# EAGLE board Cosmic Pi V2 (EAGLE 9.1.0), part 1 of 2
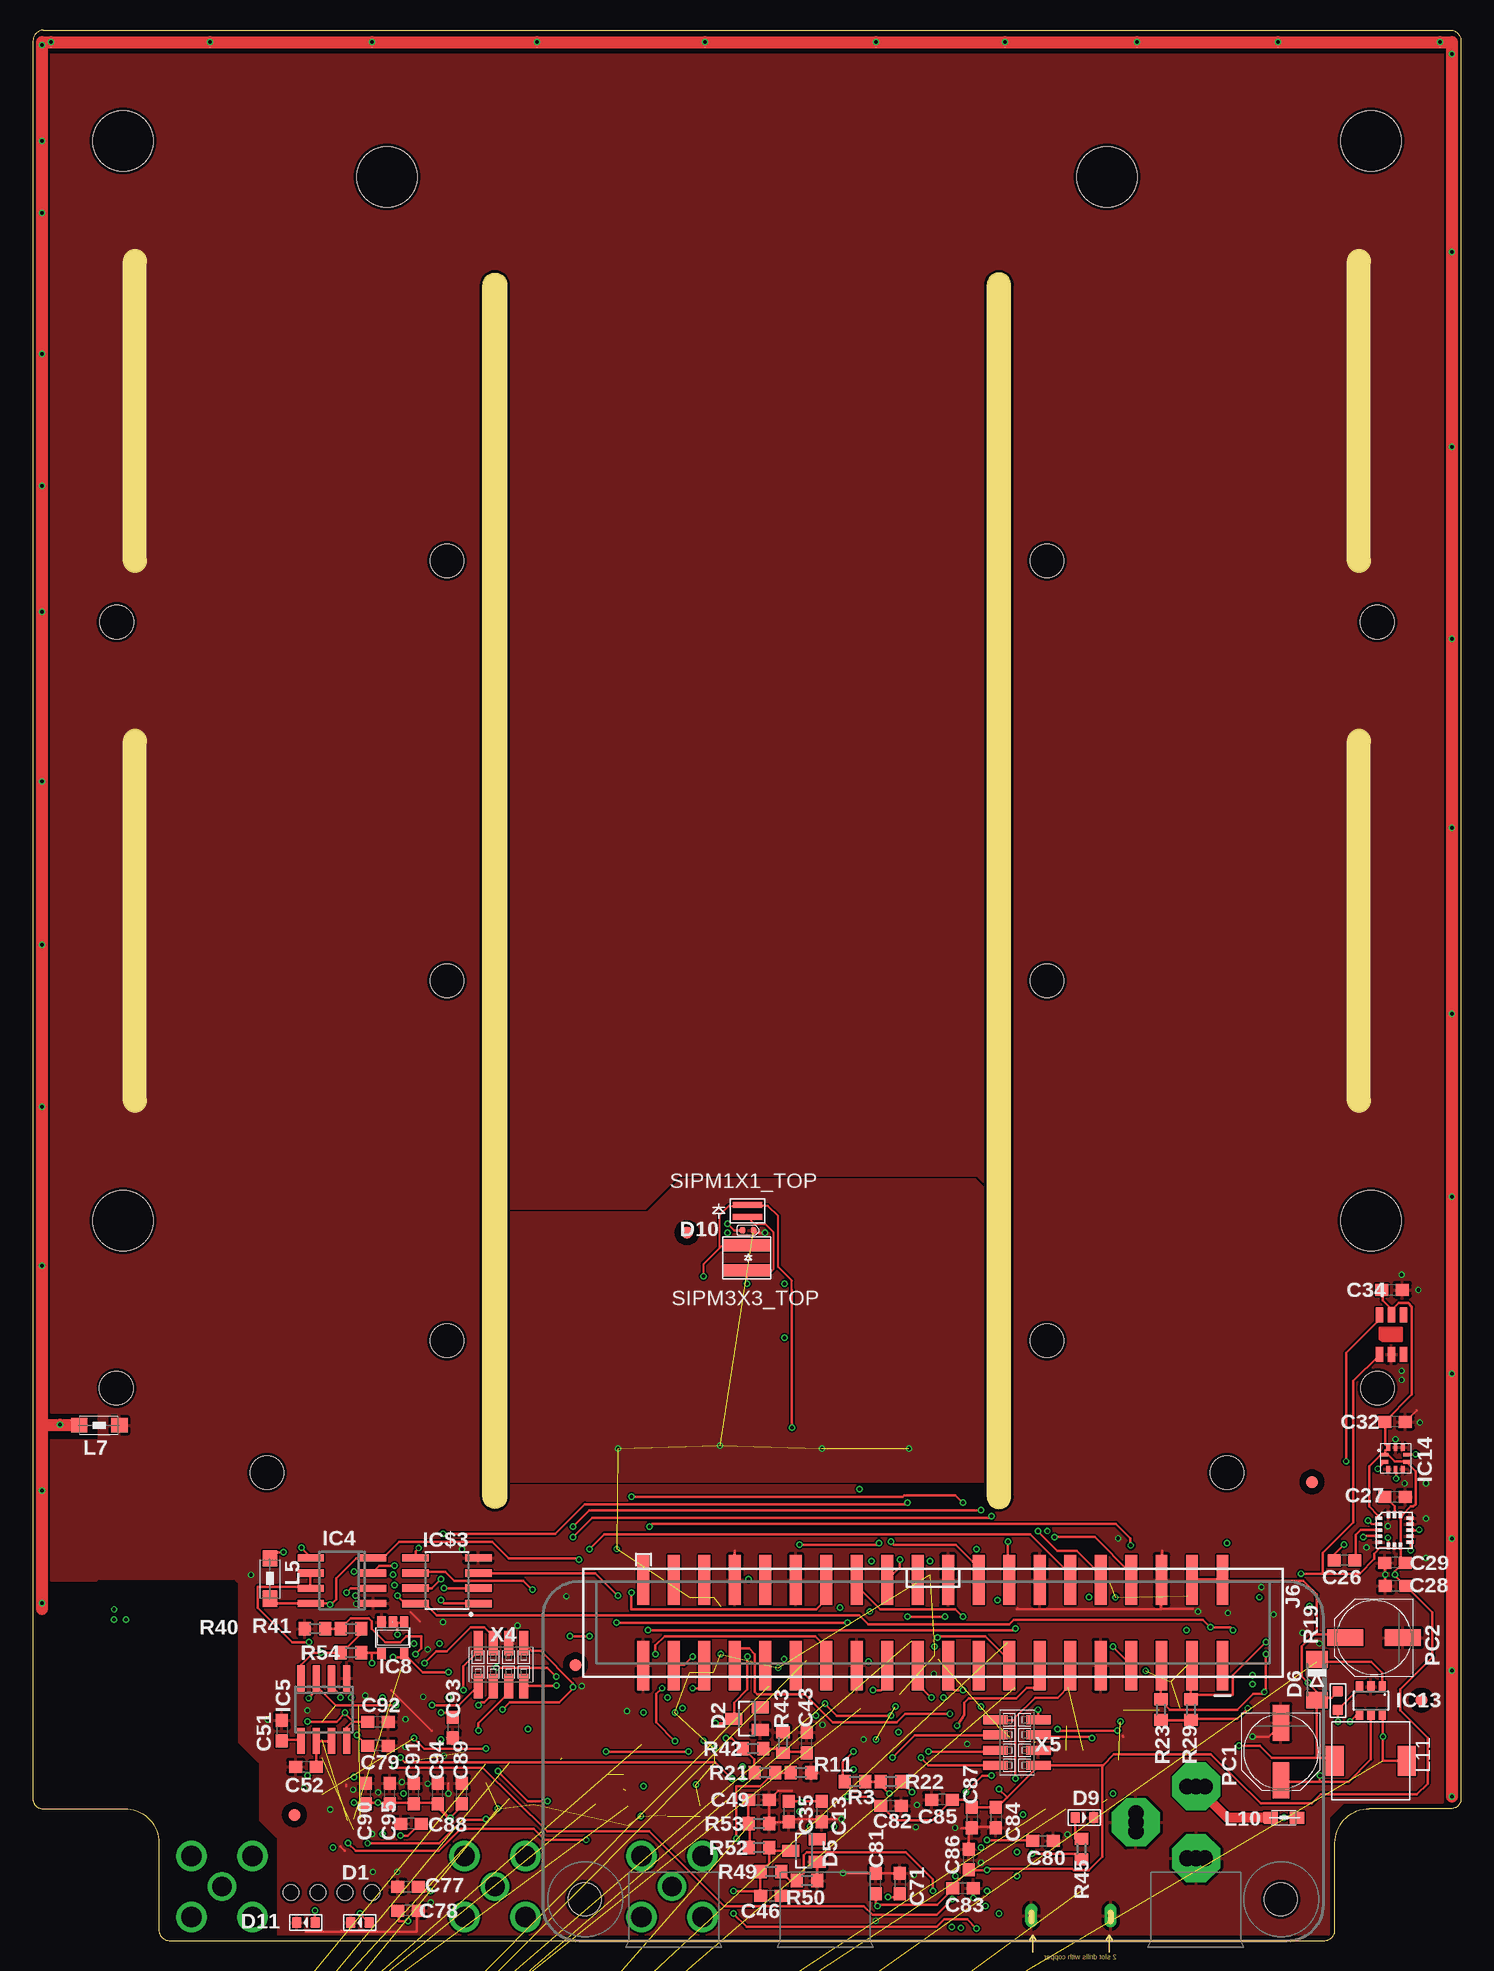
[diagram p3: board, top side]
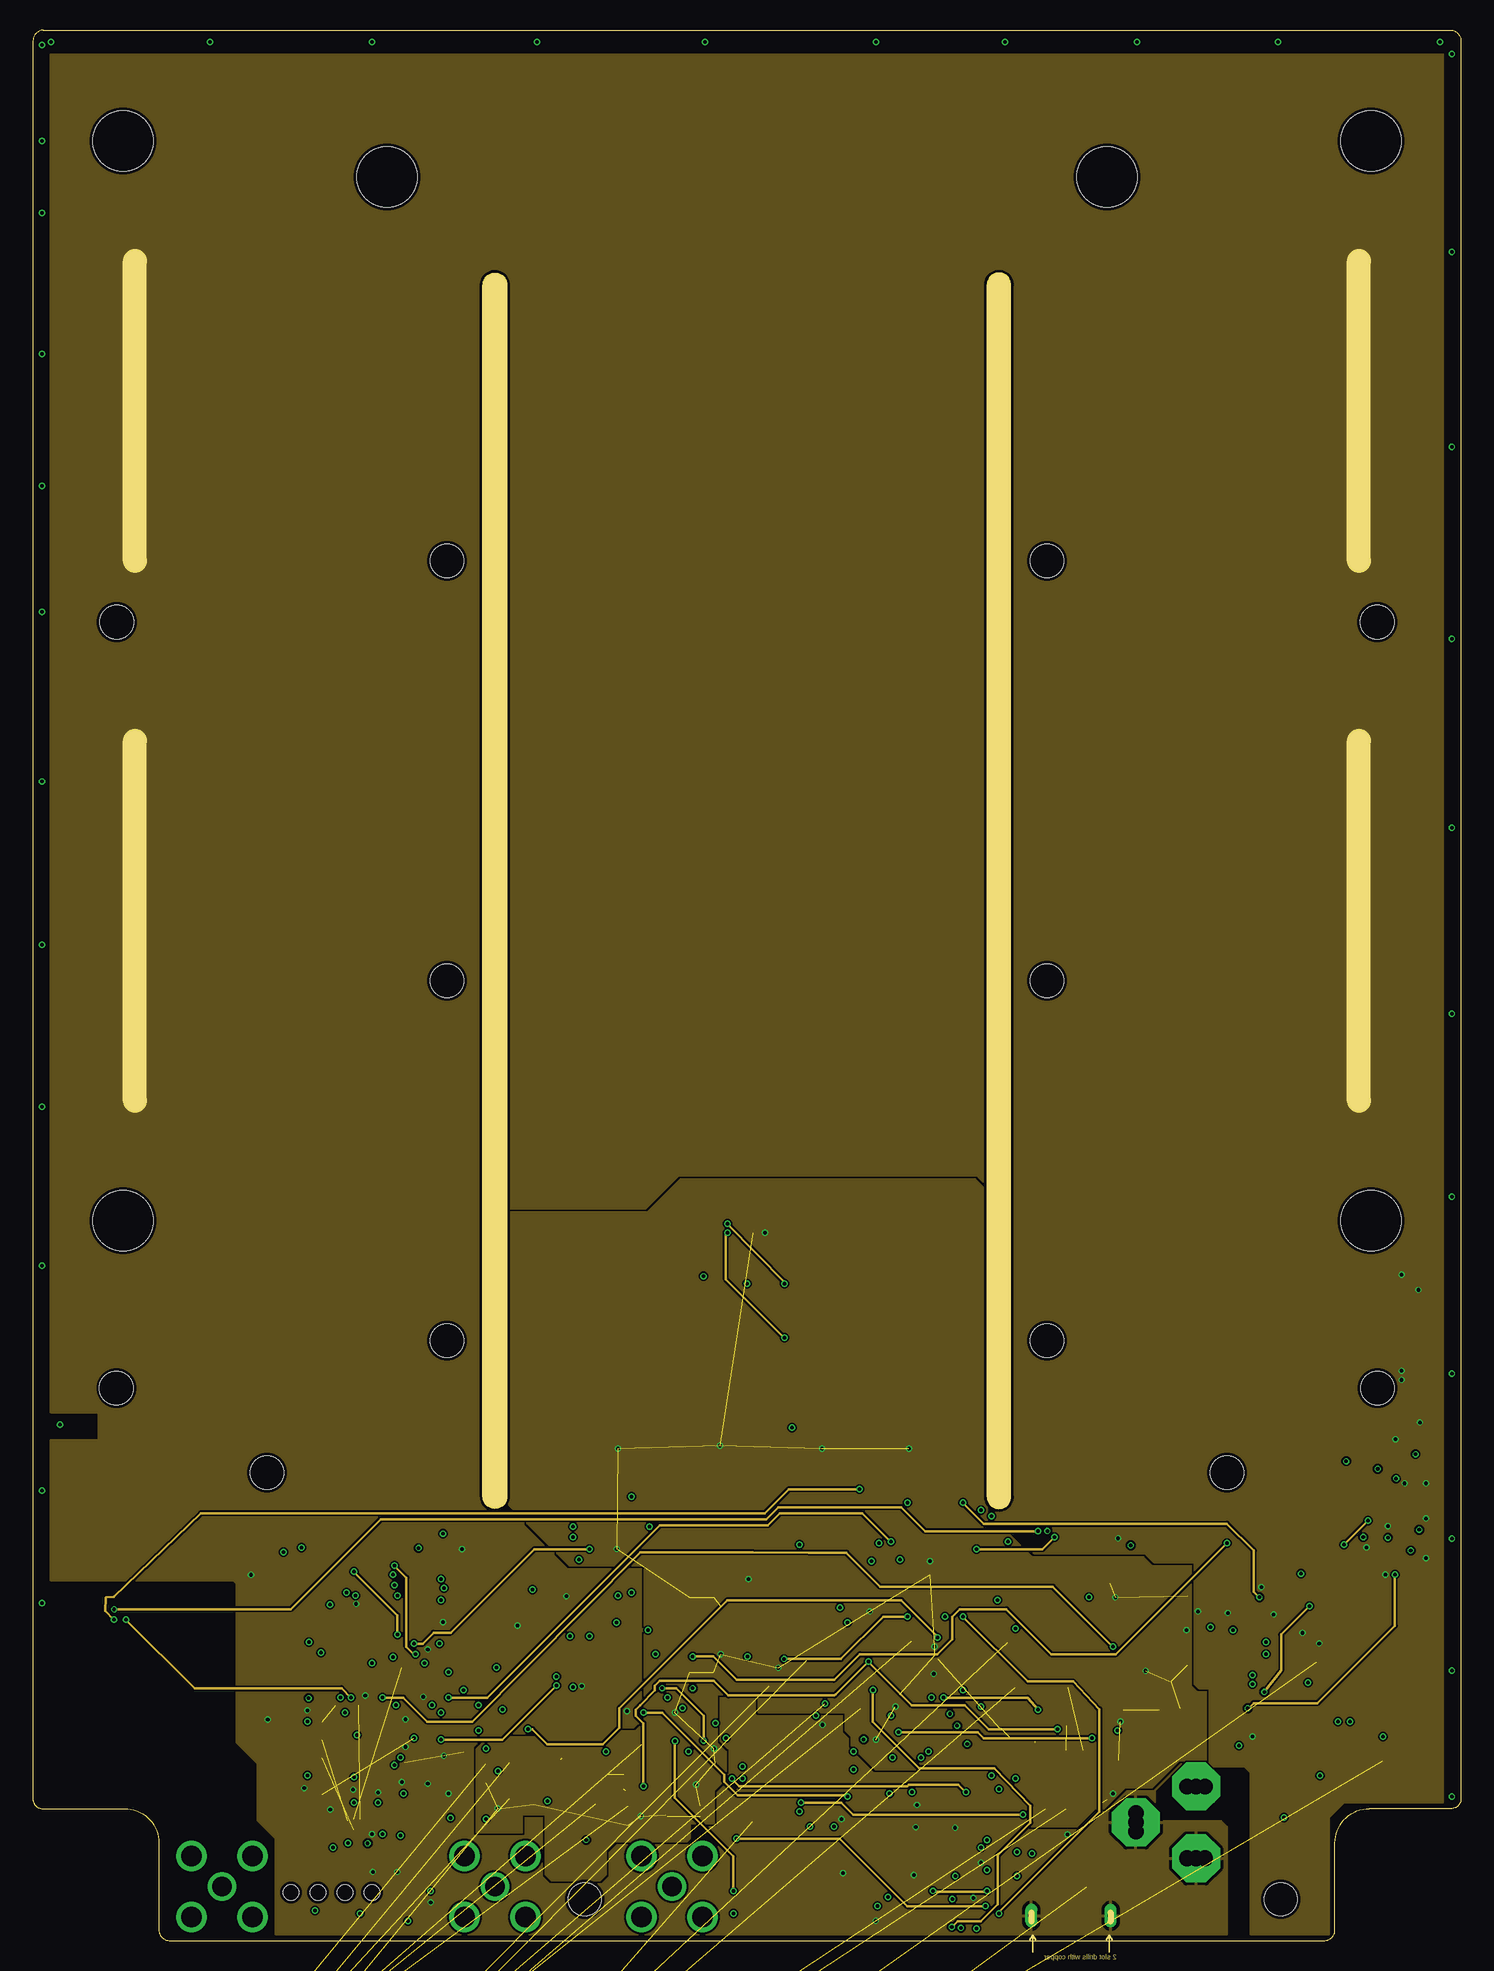
[diagram p4: board, inner layer Route2]
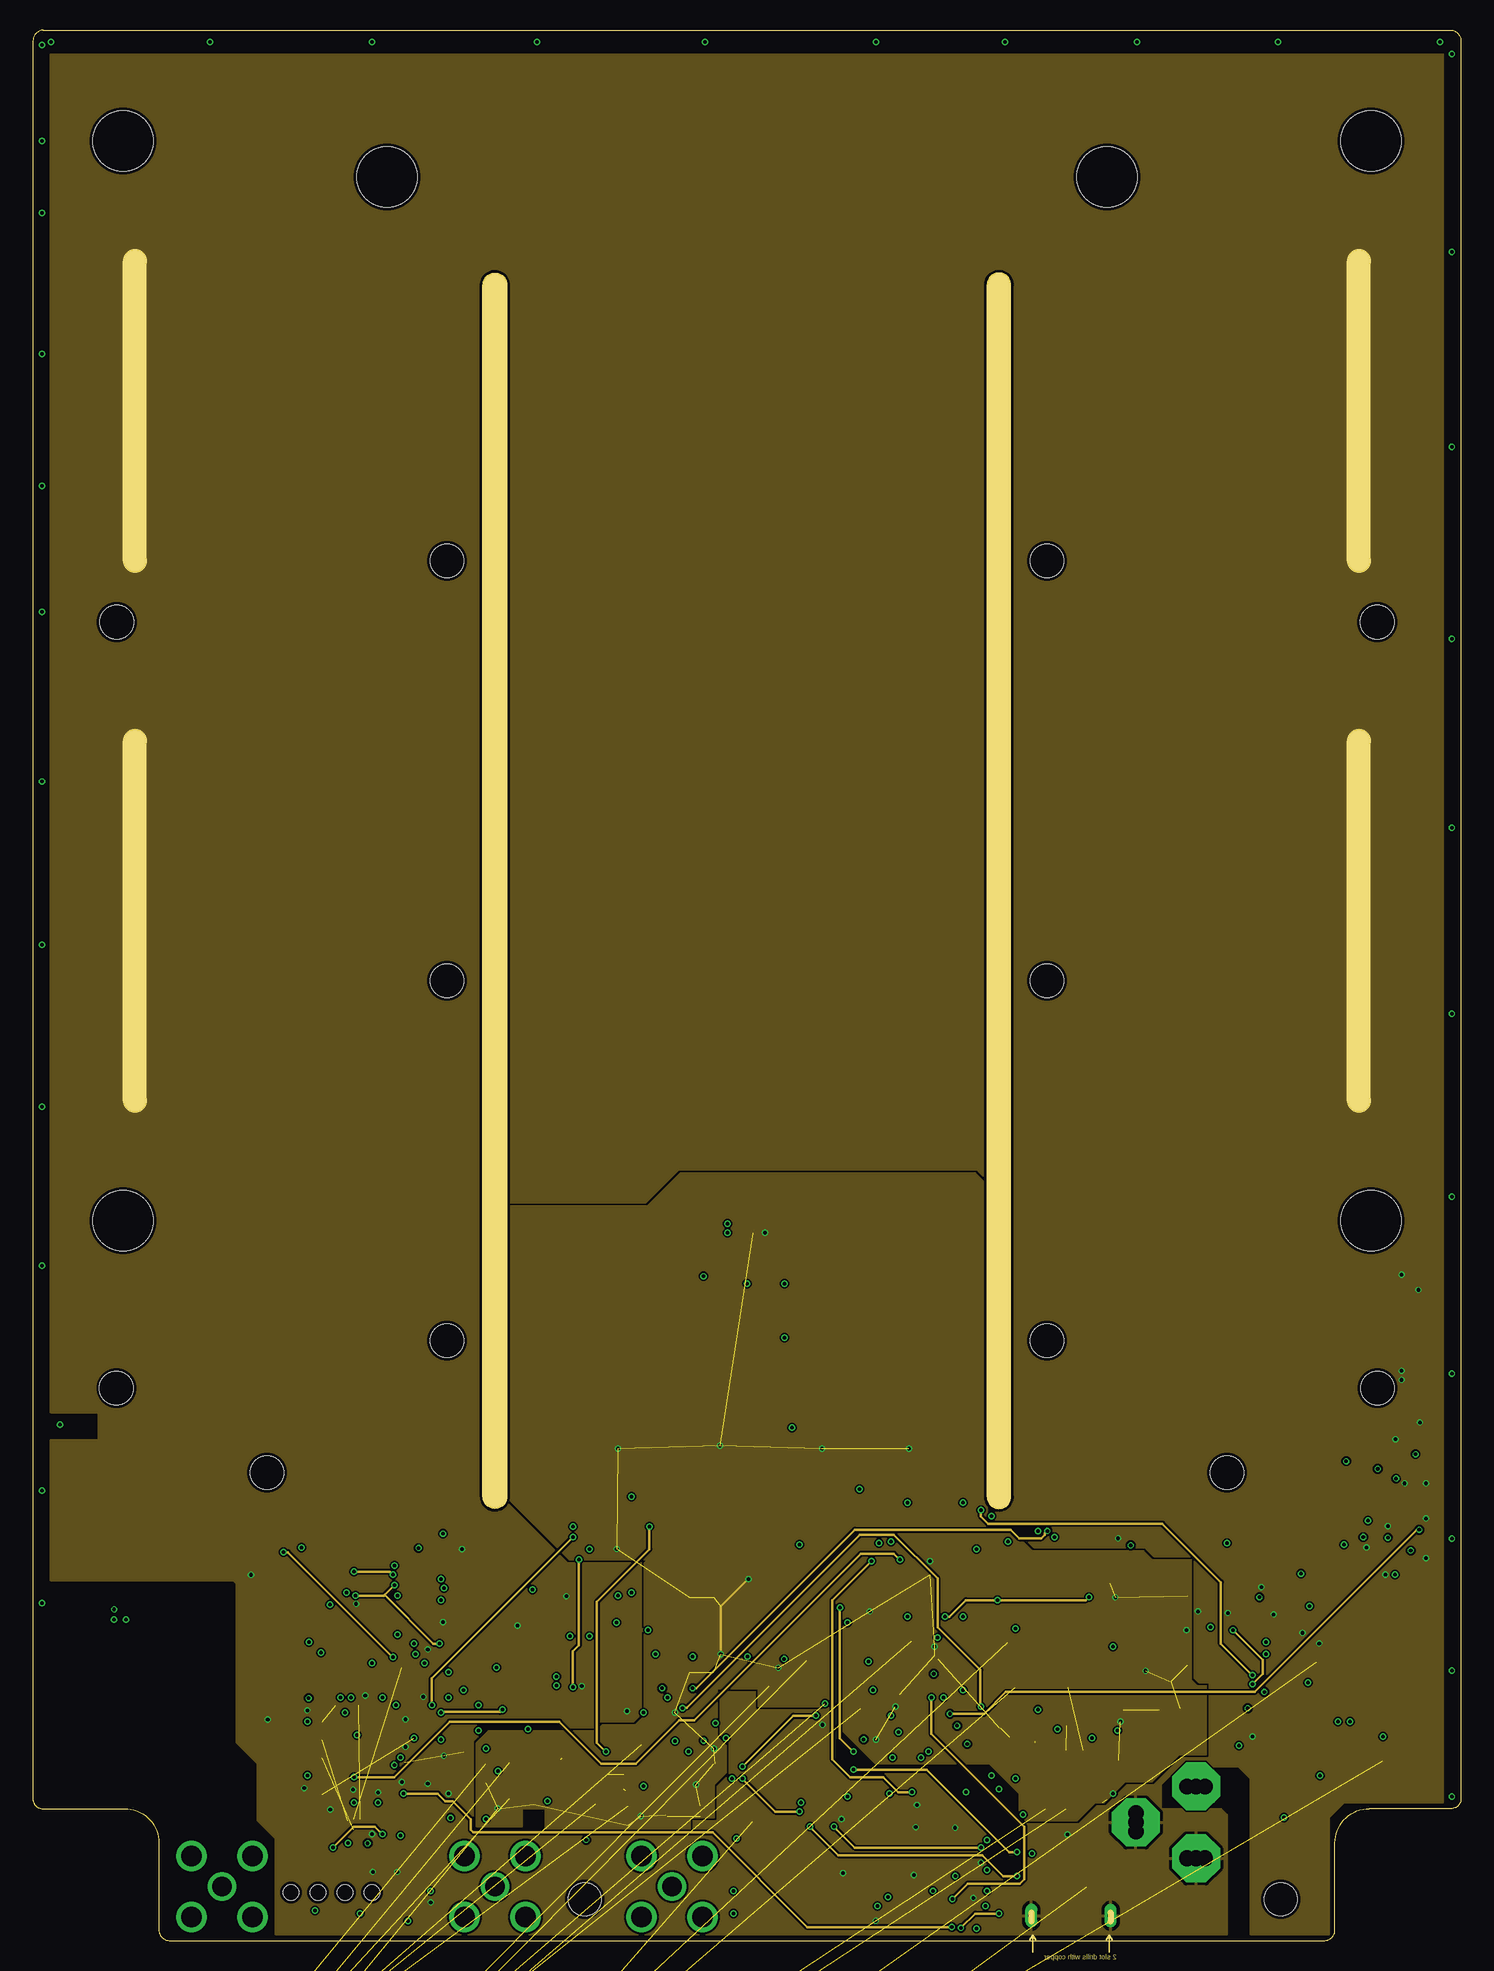
[diagram p5: board, inner layer Route15]
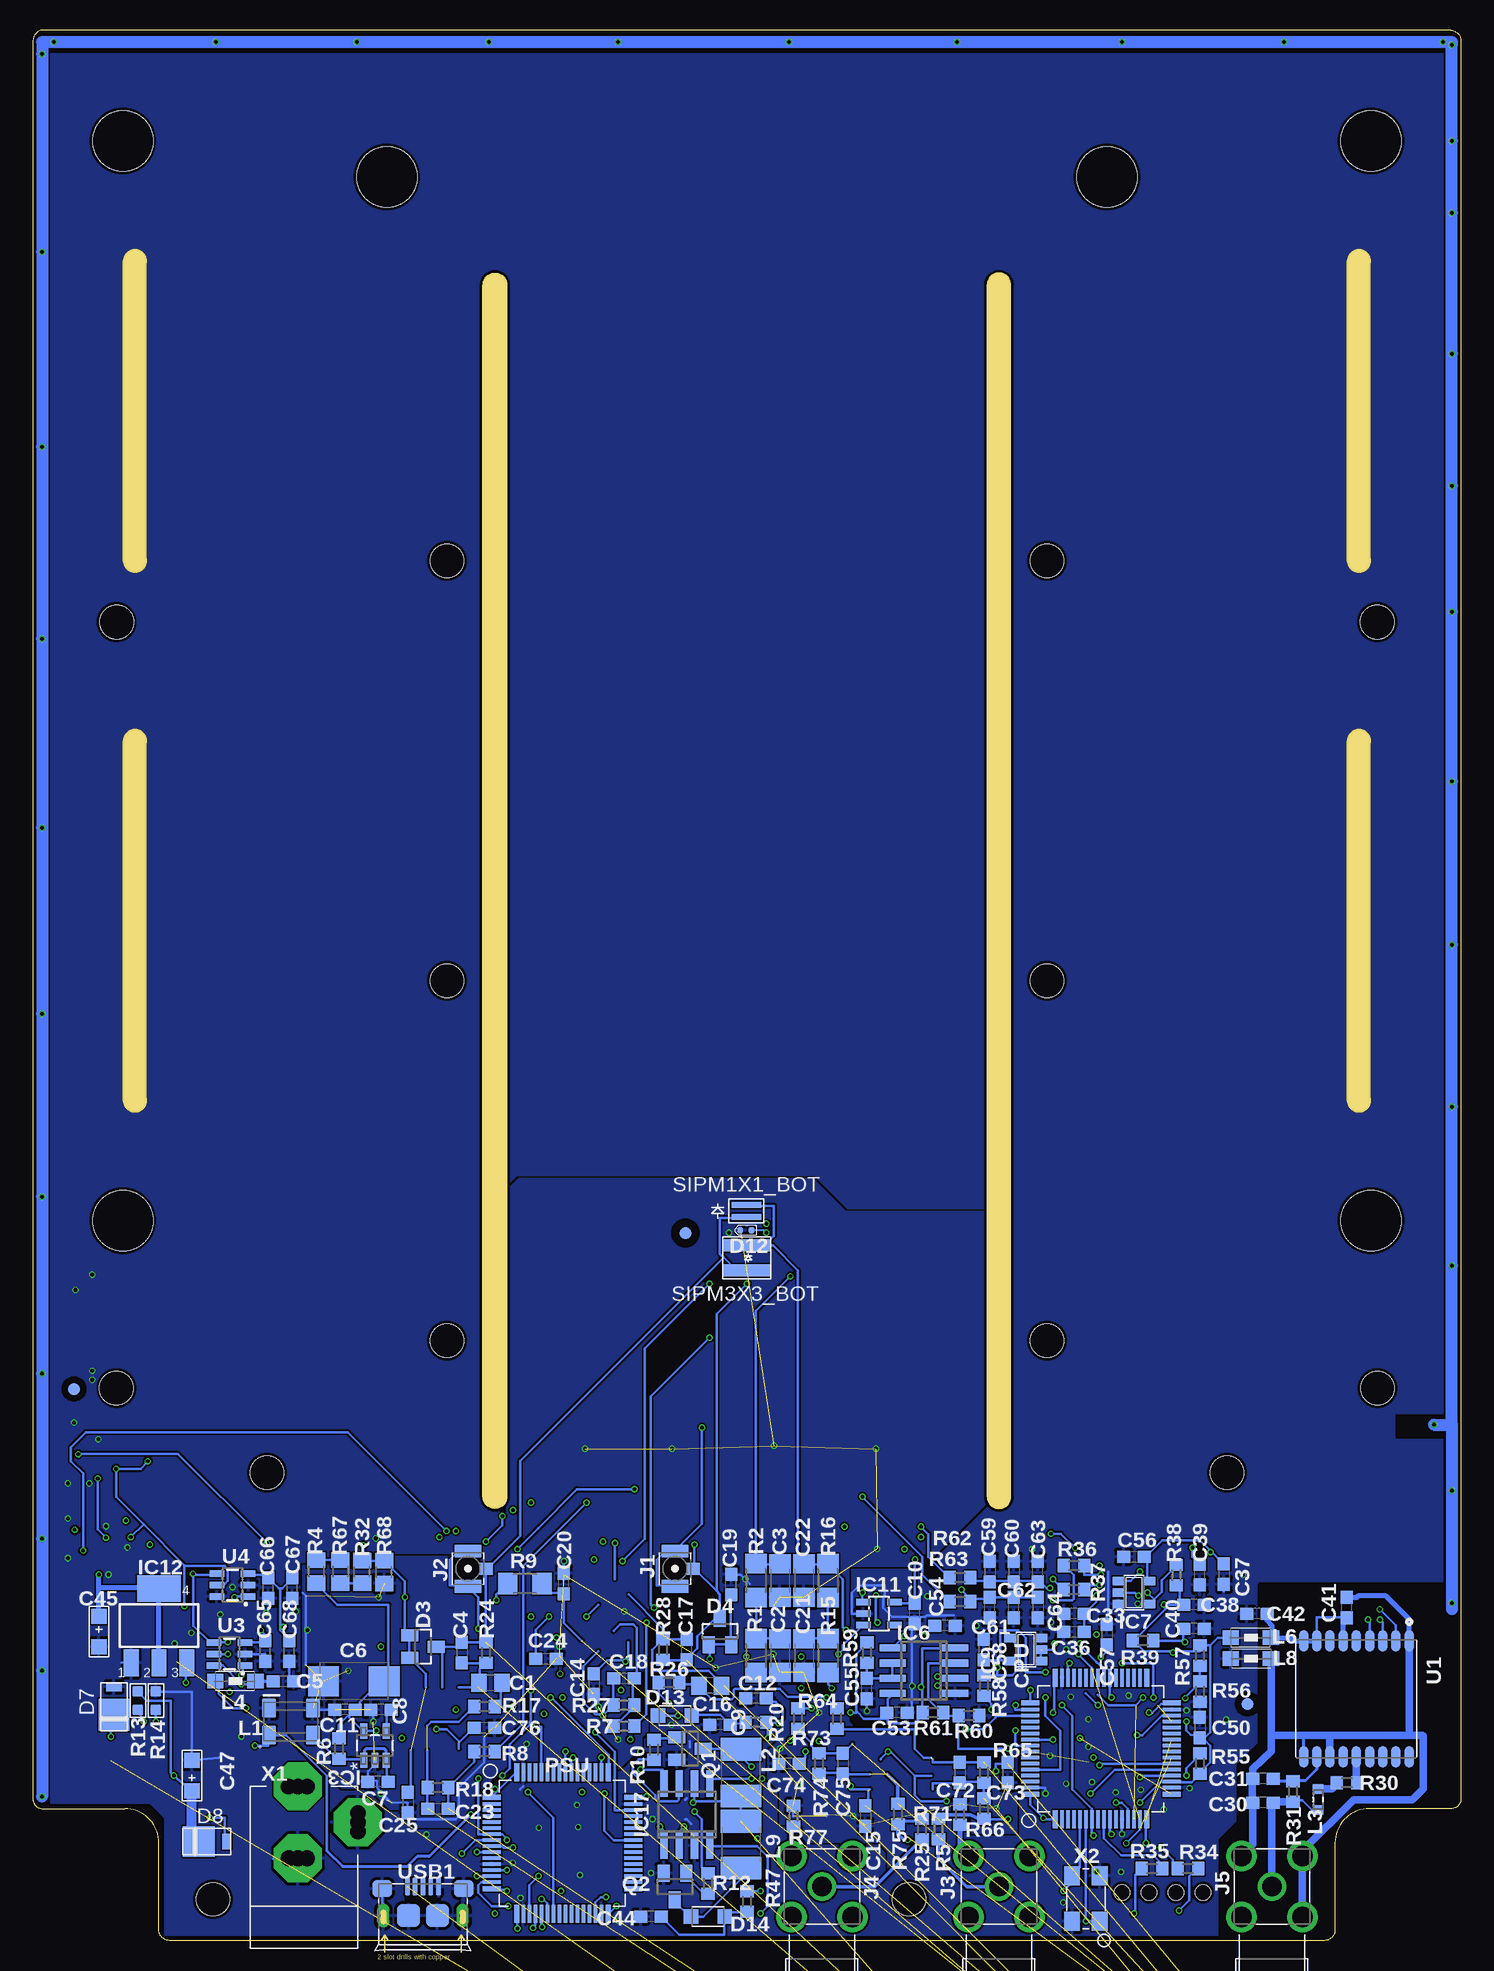
[diagram p6: board, bottom side, seen from below]

Size 119 x 159.25 mm. Coordinates in mm from the lower left corner, seen from the top.
Outline: 118.01,159.25 arc-90 119,158.4
Outline: 0.86,159.25 arc90 0,158.27
Outline: 0.86,159.25 118.01,159.25
Outline: 118.01,159.25 arc-90 119,158.4
Outline: 119,158.4 119,11.85 arc-90 118.27,11 111.37,11 arc90 108.5,8.13 108.5,0.85 arc-90 107.65,0 11.36,0 arc-90 10.5,0.85 10.5,8.13 arc90 7.63,11 0.74,11 arc-90 0,11.85 0,158.27
Outline: 0.86,159.25 arc90 0,158.27
Outline: 80.5,36 arc90 81.5,37 81.5,138 arc90 80.5,139 arc90 79.5,138 79.5,37 arc90 80.5,36
Outline: 38.5,139 arc-90 39.5,138 39.5,37 arc-90 38.5,36 arc-90 37.5,37 37.5,138 arc-90 38.5,139
Copper layers (1*2*15*16): Top 0.035mm / dielectric 0.2mm / Route2 0.0175mm / dielectric 0.3mm / Route15 0.0175mm / dielectric 0.2mm / Bottom 0.035mm
Design rules "SeeedStudio_4layer_DRU_no_angle_20140221 *": minimum track width 8mil, minimum drill 12mil, track to track 6mil, track to pad 6mil, pad to pad 6mil, via to via 6mil, smd to smd 0mil, copper to edge 10mil, drill to drill 8mil, minimum pad ring 6mil, minimum via ring 4mil, stop-mask expansion 4mil, vias tented up to drill 25mil, thermal gap 10mil
Net classes: 0 default: width 0.152 mm, drill 0.152 mm, clearance 0.152 mm; 1 Peripheral: width 0.152 mm, drill 0.406 mm, clearance 0.152 mm; 2 gnd: width 0.305 mm, drill 0.406 mm, clearance 0.254 mm; 3 timing: width 0.152 mm, drill 0.406 mm, clearance 0.152 mm; 4 Comms: width 0.152 mm, drill 0.406 mm, clearance 0.152 mm; 5 PSU: width 0.152 mm, drill 0.406 mm, clearance 0.152 mm; 6 Vbias: width 0.152 mm, drill 0.406 mm, clearance 0.356 mm; 7 ant: width 0.61 mm, drill 0.406 mm, clearance 0.61 mm
Holes 2.8 mm at 6.95,46.05 112.05,46.05 6.98,109.9 112.03,109.9 19.5,39 99.5,39 34.5,80 84.5,80 34.5,115 84.5,115 34.5,50 84.5,50
Holes 1.3 mm at 21.5,4 23.75,4 26,4 28.25,4
Holes 5 mm at 7.5,60 111.5,60 111.5,150 7.5,150 29.5,147 89.5,147
Holes 2.75 mm at 45.99,3.45 103.99,3.45
tKeepout: area 92.5,-0.5 to 97,0.5
tRestrict: area -0.5,0 to 20.3,30
Milling: 6 lines

## Footprints (pad centres in the part's own frame; a part is rotated, then mirrored left to right if it is on the bottom)
C0805 = smd 1.3 x 1.5: 1 -0.95,0; 2 0.95,0
C1206 = smd 1.6 x 1.8: 1 -1.4,0; 2 1.4,0
C0603 = smd 1.1 x 1: 1 -0.85,0; 2 0.85,0
C/6032-28R = smd 2.55 x 2.5: + 2.525,0; - -2.525,0
AVX-A = smd 1.27 x 1.27: + -1.27,0; - 1.27,0
LQFP64 = smd 1.5 x 0.4: P$1 -5.9,3.81; P$16 -5.9,-3.81; P$33 5.9,-3.81; P$48 5.9,3.81 | smd 1.5 x 0.28: P$2 -5.9,3.25; P$3 -5.9,2.75; P$4 -5.9,2.25; P$5 -5.9,1.75; P$6 -5.9,1.25; P$7 -5.9,0.75; P$8 -5.9,0.25; P$9 -5.9,-0.25; P$10 -5.9,-0.75; P$11 -5.9,-1.25; P$12 -5.9,-1.75; P$13 -5.9,-2.25; P$14 -5.9,-2.75; P$15 -5.9,-3.25; P$34 5.9,-3.25; P$35 5.9,-2.75; P$36 5.9,-2.25; P$37 5.9,-1.75; P$38 5.9,-1.25; P$39 5.9,-0.75; P$40 5.9,-0.25; P$41 5.9,0.25; P$42 5.9,0.75; P$43 5.9,1.25; P$44 5.9,1.75; P$45 5.9,2.25; P$46 5.9,2.75; P$47 5.9,3.25 | smd 0.4 x 1.5: P$17 -3.81,-5.9; P$32 3.81,-5.9; P$49 3.81,5.9; P$64 -3.81,5.9 | smd 0.28 x 1.5: P$18 -3.25,-5.9; P$19 -2.75,-5.9; P$20 -2.25,-5.9; P$21 -1.75,-5.9; P$22 -1.25,-5.9; P$23 -0.75,-5.9; P$24 -0.25,-5.9; P$25 0.25,-5.9; P$26 0.75,-5.9; P$27 1.25,-5.9; P$28 1.75,-5.9; P$29 2.25,-5.9; P$30 2.75,-5.9; P$31 3.25,-5.9; P$50 3.25,5.9; P$51 2.75,5.9; P$52 2.25,5.9; P$53 1.75,5.9; P$54 1.25,5.9; P$55 0.75,5.9; P$56 0.25,5.9; P$57 -0.25,5.9; P$58 -0.75,5.9; P$59 -1.25,5.9; P$60 -1.75,5.9; P$61 -2.25,5.9; P$62 -2.75,5.9; P$63 -3.25,5.9
LED-0603 = smd 0.762 x 0.889: + -0.762,0; - 0.762,0
SOT23 = smd 1 x 1.4: 1 -0.95,-1.1; 2 0.95,-1.1; 3 0,1.1
MINIMELF = smd 1.4 x 1.8: A 1.7,0; C -1.7,0
DO220AAL = smd 2.667 x 2.54: P$1 -0.7,0 | smd 0.762 x 1.27: P$2 1.65,0
LED-0402 = smd 0.5 x 0.5: + -0.463,0; - 0.463,0
SOD123F = smd 1.2 x 1.2: 1 -1.4,0; 2 1.4,0
SO8 = smd 0.6 x 2.2: 1 -1.905,-2.6; 2 -0.635,-2.6; 3 0.635,-2.6; 4 1.905,-2.6; 5 1.905,2.6; 6 0.635,2.6; 7 -0.635,2.6; 8 -1.905,2.6
SOT95P284X120-5N = smd 1.27 x 0.559: 1 -1.219,0.94; 2 -1.219,0; 3 -1.219,-0.94; 4 1.219,-0.94; 5 1.219,0.94
SO08 = smd 0.6 x 2.2: 1 -1.905,-2.6; 2 -0.635,-2.6; 3 0.635,-2.6; 4 1.905,-2.6; 5 1.905,2.6; 6 0.635,2.6; 7 -0.635,2.6; 8 -1.905,2.6
SOT23-5 = smd 0.69 x 0.99: 1 -0.95,-1.29; 2 0,-1.29; 3 0.95,-1.29; 4 0.95,1.3; 5 -0.95,1.3
SOT23-5L = smd 0.55 x 1.2: 1 -0.95,-1.3; 2 0,-1.3; 3 0.95,-1.3; 4 0.95,1.3; 5 -0.95,1.3
SOT223 = smd 1.219 x 2.235: 1 -2.311,-3.099; 2 0,-3.099; 3 2.311,-3.099 | smd 3.6 x 2.2: 4 0,3.099
SOT23-6 = smd 0.6 x 0.9: 1 -0.95,-1.15; 2 0,-1.15; 3 0.95,-1.15; 4 0.95,1.15; 5 0,1.15; 6 -0.95,1.15
LPS25H = smd 0.32 x 0.55: 1 -0.3,-0.9; 2 0.3,-0.9; 6 0.3,0.9; 7 -0.3,0.9 | smd 0.55 x 0.32: 3 0.9,-0.6; 4 0.9,0; 5 0.9,0.6; 8 -0.9,0.6; 9 -0.9,0; 10 -0.9,-0.6
3X3DFN = smd 1.27 x 0.635: P$1 -0.2,0; P$2 -0.2,-1; P$3 -0.2,-2; P$4 3.1,-2; P$5 3.1,-1; P$6 3.1,0
LGA16L = smd 0.6 x 0.3: P$1 -1.3,1; P$2 -1.3,0.5; P$3 -1.3,0; P$4 -1.3,-0.5; P$5 -1.3,-1; P$9 1.3,-1; P$10 1.3,-0.5; P$11 1.3,0; P$12 1.3,0.5; P$13 1.3,1 | smd 0.3 x 0.6: P$6 -0.5,-1.3; P$7 0,-1.3; P$8 0.5,-1.3; P$14 0.5,1.3; P$15 0,1.3; P$16 -0.5,1.3
ANALOG-DEVICES_SO8 = smd 0.6 x 2.2: 1 -1.905,-2.6; 2 -0.635,-2.6; 3 0.635,-2.6; 4 1.905,-2.6; 5 1.905,2.6; 6 0.635,2.6; 7 -0.635,2.6; 8 -1.905,2.6
SOIC-8 = smd 0.61 x 2.21: 1 -1.905,-2.616; 2 -0.635,-2.616; 3 0.635,-2.616; 4 1.905,-2.616; 5 1.905,2.616; 6 0.635,2.616; 7 -0.635,2.616; 8 -1.905,2.616
HRS_U.FL-R-SMT-1(10) = smd 1.05 x 2.2: 1 -1.475,0; 3 1.475,0 | smd 1 x 1.05: 2 0,-1.525
5-1814400-1_TE_5-1814400-1 = drill 1.7 pad 2.3: 1 -2.54,2.54; 2 -2.54,-2.54; 3 2.54,-2.54; 4 2.54,2.54 | drill 1.6 pad 2.2: 5 0,0
TE_5-1814400-1 = drill 1.7 pad 2.3: 1 -2.54,2.54; 2 -2.54,-2.54; 3 2.54,-2.54; 4 2.54,2.54 | drill 1.6 pad 2.2: 5 0,0
2X20_SHROUDED_SMT = smd 4.14 x 0.991: 1 3.569,24.13; 2 -3.569,24.13; 3 3.569,21.59; 4 -3.569,21.59; 5 3.569,19.05; 6 -3.569,19.05; 7 3.569,16.51; 8 -3.569,16.51; 9 3.569,13.97; 10 -3.569,13.97; 11 3.569,11.43; 12 -3.569,11.43; 13 3.569,8.89; 14 -3.569,8.89; 15 3.569,6.35; 16 -3.569,6.35; 17 3.569,3.81; 18 -3.569,3.81; 19 3.569,1.27; 20 -3.569,1.27; 21 3.569,-1.27; 22 -3.569,-1.27; 23 3.569,-3.81; 24 -3.569,-3.81; 25 3.569,-6.35; 26 -3.569,-6.35; 27 3.569,-8.89; 28 -3.569,-8.89; 29 3.569,-11.43; 30 -3.569,-11.43; 31 3.569,-13.97; 32 -3.569,-13.97; 33 3.569,-16.51; 34 -3.569,-16.51; 35 3.569,-19.05; 36 -3.569,-19.05; 37 3.569,-21.59; 38 -3.569,-21.59; 39 3.569,-24.13; 40 -3.569,-24.13
WE-CNSW_1812 = smd 1.15 x 1.55: 1 -1.825,-1.125; 2 1.825,-1.125; 3 1.825,1.125; 4 -1.825,1.125
L1812 = smd 1.9 x 3.4: 1 -1.95,0; 2 1.95,0
INDC1608X90N = smd 0.787 x 0.889: 1 -0.889,0; 2 0.889,0
1206 = smd 1.35 x 1.2: 1 -1.675,0; 2 1.675,0
0805 = smd 1.2 x 1: 1 -1.1,0; 2 1.1,0
SRR0604 = smd 1.5 x 2.5: P$1 3,0; P$2 -3,0
PANASONIC_D = smd 3 x 1.4: + 2.4,0; - -2.4,0
R1206 = smd 1.6 x 1.803: 1 -1.422,0; 2 1.422,0
R0603 = smd 1 x 1.1: 1 -0.85,0; 2 0.85,0
R0805 = smd 1.3 x 1.5: 1 -0.95,0; 2 0.95,0
R0603' = smd 0.889 x 0.889: 1 0,0.762; 2 0,-0.762
DIODE_ASD-NUV1S-P = smd 0.5 x 2.45: P$1 1,-2; P$2 2,-2
DIODE_ASD-NUV3S-P = smd 1 x 3.83: P$1 0.7,-2; P$2 2.8,-2
CAPCAV110P970X1010X250-18N = smd 1.8 x 0.8: 1 -4.85,4.4; 2 -4.85,3.3; 3 -4.85,2.2; 4 -4.85,1.1; 5 -4.85,0; 6 -4.85,-1.1; 7 -4.85,-2.2; 8 -4.85,-3.3; 9 -4.85,-4.4; 10 4.85,-4.4; 11 4.85,-3.3; 12 4.85,-2.2; 13 4.85,-1.1; 14 4.85,0; 15 4.85,1.1; 16 4.85,2.2; 17 4.85,3.3; 18 4.85,4.4
SOT23-6' = smd 0.55 x 1.2: 1 0.95,1.3; 2 0,1.3; 3 -0.95,1.3; 4 -0.95,-1.3; 5 0,-1.3; 6 0.95,-1.3
FIDUCIAL_1MM = smd 1 x 1: 1 0,0
MICRO-USB5+6P-SMD-0.65-B = smd 0.4 x 1.5: 1 -1.3,-0.25; 2 -0.65,-0.25; 3 0,-0.25; 4 0.65,-0.25; 5 1.3,-0.25 | smd 1.6 x 1.4: S1 -3.4,-0.427; S6 3.4,-0.427 | drill 0.508 pad 1.016 long: S2 -3.3,-2.675; S5 3.3,-2.675 | smd 1.9 x 1.9: S3 -1.2,-2.675; S4 1.2,-2.675
POWERSUPPLY_DC-21MM = drill 1.3 pad 4 octagon: 1 -5.08,-3.353; 2 -0.076,-6.35; 3 -0.076,-0.356 | drill 1.3: 4 -5.08,-4.115; 5 -5.08,-2.591; 6 -0.838,-0.356; 7 0.686,-0.356; 8 -0.838,-6.35; 9 0.686,-6.35
X5032_4P = smd 1.6 x 1.3: P$1 -1.9,-1.15; P$2 1.9,-1.15; P$3 1.9,1.15; P$4 -1.9,1.15
1296-08 = smd 0.76 x 2.05: 1 -1.905,-1.78; 2 -1.905,1.78; 3 -0.635,-1.78; 4 -0.635,1.78; 5 0.635,-1.78; 6 0.635,1.78; 7 1.905,-1.78; 8 1.905,1.78

## Placement (x,y rotation side)
C1  100n ECPU  [C0805]  80.88,21.5 0 bottom
C2  1u  [C1206]  56.75,23.75 270 bottom
C3  1u  [C1206]  56.75,30 270 bottom
C4  30p NP0  [C0603]  83.25,24 270 bottom
C5  10n  [C0603]  98.13,21.62 0 bottom
C6  100u  [C/6032-28R]  92.25,21.62 0 bottom
C7  1u  [C0603]  90.25,13.25 180 bottom
C8  10n  [C0603]  90,19.25 180 bottom
C9  100n  [C0603]  61.75,18 180 bottom
C10  100n  [C0603]  45.5,27.25 90 bottom
C11  2.2u  [C0603]  93,19.25 180 bottom
C12  47n  [C0603]  58.75,20.2 180 bottom
C13  1u  [C0603]  65.75,10.75 270 top
C14  100n  [C0603]  72.25,21.38 270 bottom
C15  100n  [C0603]  49.63,10.38 270 bottom
C16  100n ECPU  [C0805]  62.56,21.25 180 bottom
C17  30p NP0  [C0603]  64.5,24.25 90 bottom
C18  n.a.  [C0603]  69.75,21.88 0 bottom
C19  100n  [C0603]  60.83,29.68 90 bottom
C20  100n  [C0603]  74.75,29.75 90 bottom
C21  1u  [C1206]  54.75,23.75 270 bottom
C22  1u  [C1206]  54.75,30 270 bottom
C23  n.a.  [C0603]  85.25,11 0 bottom
C24  100n  [C0603]  76.25,23.5 0 bottom
C25  100n  [C0603]  87.75,11.5 270 bottom
C26  10u  [C0603]  109.3,31.7 180 top
C27  4.7u  [C0603]  113.5,37 0 top
C28  10u  [C0603]  113.55,29.55 180 top
C29  100n  [C0603]  113.5,31.5 180 top
C30  nm  [C0603]  16.5,11.5 180 bottom
C31  nm  [C0603]  16.5,13.5 180 bottom
C32  100n  [C0603]  113.5,43.25 180 top
C33  100n  [C0603]  32.25,27.25 180 bottom
C34  100n  [C0603]  113.25,54.25 0 top
C35  100n  [C0603]  63,10.75 270 top
C36  100n  [C0603]  32.25,25.75 0 bottom
C37  10n  [C0603]  19.76,30.55 270 bottom
C38  100n  [C0603]  22.25,28 180 bottom
C39  10n  [C0603]  21.75,30.5 90 bottom
C40  220n  [C0603]  22.25,26 180 bottom
C41  100n  [C0603]  9.5,27.75 90 bottom
C42  10n  [C0603]  17,27.25 180 bottom
C43  1n  [C0603]  64.5,16.5 90 top
C44  100n  [C0603]  67.5,2 180 bottom
C45  10uf  [AVX-A]  113.5,25.75 270 bottom
C46  47n  [C0603]  61.5,3.75 0 top
C47  10uf  [AVX-A]  105.75,13.75 90 bottom
C48  10n  [C0603]  0.42,-51.51 0 top  (outside the outline)
C49  1n  [C0603]  60.5,11.75 0 top
C50  100n  [C0603]  21.75,17.75 270 bottom
C51  10n  [C0603]  20.75,17.5 270 top
C52  220n  [C0603]  22.75,14.5 0 top
C53  100n  [C0603]  47,19 180 bottom
C54  10n  [C0603]  43,26.25 180 bottom
C55  220n  [C0603]  49.5,21 90 bottom
C56  100n  [C0603]  27.25,32 0 bottom
C57  100n  [C0603]  29.5,25.5 270 bottom
C58  100n  [C0603]  39.75,24.25 270 bottom
C59  100n  [C0603]  39.25,30.75 270 bottom
C60  10n  [C0603]  37.25,30.75 270 bottom
C61  100n  [C0603]  39.25,27.75 90 bottom
C62  10n  [C0603]  37.25,27.75 90 bottom
C63  1n  [C0603]  35.25,30.75 90 bottom
C64  1n  [C0603]  35.25,27.75 270 bottom
C65  100n  [C0603]  99.63,24.12 90 bottom
C66  100n  [C0603]  99.38,29.38 90 bottom
C67  10u  [C0603]  97.38,29.38 90 bottom
C68  10u  [C0603]  97.63,24.12 90 bottom
C71  4.7u  [C0603]  72.25,4.75 270 top
C72  1n  [C0603]  41.75,14 270 bottom
C73  100n  [C0603]  37.75,14 270 bottom
C74  100n  [C0603]  56,14.75 180 bottom
C75  1n  [C0603]  51.5,14.75 270 bottom
C76  100n  [C0603]  81.38,17.75 0 bottom
C77  20p  [C0603]  31.25,4.5 0 top
C78  20p  [C0603]  31.25,2.5 180 top
C79  4.7u  [C0603]  28.75,16.25 180 top
C80  100n  [C0603]  84.18,8.3 0 top
C81  100n  [C0603]  70.25,4.75 90 top
C82  100n  [C0603]  71.5,11.25 0 top
C83  1u  [C0603]  77.5,4.38 0 top
C84  100n  [C0603]  80.25,10.25 270 top
C85  100n  [C0603]  75.75,11.75 180 top
C86  100n  [C0603]  78,6.75 90 top
C87  4.7u  [C0603]  78.25,10.25 270 top
C88  100n  [C0603]  31.5,9.75 180 top
C89  4.7u  [C0603]  35.75,12.25 90 top
C90  100n  [C0603]  27.75,12.25 90 top
C91  100n  [C0603]  31.75,12.25 90 top
C92  100n  [C0603]  28.75,18.25 0 top
C93  100n  [C0603]  35,17.75 270 top
C94  100n  [C0603]  33.75,12.25 90 top
C95  1u  [C0603]  29.75,12.25 90 top
CPU  310010495_STM32F401RET6  [LQFP64]  30,16 90 bottom
D1  BLUE-0603  [LED-0603]  27.25,1.5 180 top
D2  DNP  [SOT23]  59.5,18.5 90 top
D3  BAS70-04  [SOT23]  86.5,24.5 270 bottom
D4  BAS70-04  [SOT23]  61.75,25.75 0 bottom
D5  DNP  [SOT23]  64.25,7.5 90 top
D6  CD1206-S01575  [MINIMELF]  107,21.75 270 top
D7  SS1P3L  [DO220AAL]  112.25,19.5 90 bottom
D8  SS1P3L  [DO220AAL]  104.5,8.25 0 bottom
D9  GREEN-0603  [LED-0603]  87.63,10.25 0 top
D10  BLUE-0402  [LED-0402]  59.6,59.2 0 top
D11  GREEN-0603  [LED-0603]  22.75,1.5 180 top
D12  BLUE-0402  [LED-0402]  59.6,59.2 180 bottom
D13  BAT46WH  [SOD123F]  65.5,18.75 180 bottom
D14  BAT46WH  [SOD123F]  62.75,2 180 bottom
D15  SS1P3L  [DO220AAL]  1.94,-57.15 0 top  (outside the outline)
IC1  AD8039R  [SO8]  3.92,-35.81 0 top  (outside the outline)
IC2  AD8039R  [SO8]  3.92,-45.11 0 top  (outside the outline)
IC3  LP2985IM5-3.1  [SOT95P284X120-5N]  90.5,16.25 90 bottom
IC4  LM555D  [SO08]  25.75,30 90 top
IC5  LM555D  [SO08]  24.25,19.25 180 top
IC6  LM555D  [SO08]  44.75,22.5 90 bottom
IC7  74AUC1G00DBV  [SOT23-5]  27.25,29 270 bottom
IC8  74AUC1G00DBV  [SOT23-5]  30,25.25 180 top
IC9  74AUC1G00DBV  [SOT23-5]  36.25,24.25 90 bottom
IC10  AD8039R  [SO8]  3.92,-26.52 0 top  (outside the outline)
IC11  24C00OT  [SOT23-5L]  48.5,27.25 270 bottom
IC12  NCP1117ST33T3G -3V3  [SOT223]  108.5,26.25 0 bottom
IC13  LM2734Y  [SOT23-6]  111.5,20 180 top
IC14  LPS25H  [LPS25H]  113.55,40.2 270 top
IC15  SI7006A20  [3X3DFN]  112.2,49.05 90 top
IC16  LSM303D  [LGA16L]  113.45,34.2 0 top
IC17  UCC27528UCC27528DR  [ANALOG-DEVICES_SO8]  64.5,10.5 0 bottom
IC$3  MAX991ESA+  [SOIC-8]  34.5,30 90 top
J1  U.FL-R-SMT-1(10)  [HRS_U.FL-R-SMT-1(10)]  65.5,31 90 bottom
J2  U.FL-R-SMT-1(10)  [HRS_U.FL-R-SMT-1(10)]  82.75,31 90 bottom
J3  5-1814400-1_5-1814400-1  [5-1814400-1_TE_5-1814400-1]  38.5,4.5 0 bottom
J4  5-1814400-1_5-1814400-1  [5-1814400-1_TE_5-1814400-1]  53.25,4.5 0 bottom
J5  5-1814400-1  [TE_5-1814400-1]  15.75,4.5 0 bottom
J6  CONN_20X2SHROUDED_SMT  [2X20_SHROUDED_SMT]  75,26.5 270 top
L1  1 uH CM choke  [WE-CNSW_1812]  97.5,18.25 0 bottom
L2  150uH  [L1812]  60,14 90 bottom
L3  47nH  [INDC1608X90N]  11.9,11.75 90 bottom
L4  600R/100MHz  [1206]  102.13,21.62 180 bottom
L5  600R/100MHz  [1206]  19.75,30.18 270 top
L6  600R/100MHz  [1206]  17.5,25.25 180 bottom
L7  600R/100MHz  [1206]  5.53,42.95 180 top
L8  600R/100MHz  [1206]  17.5,23.5 0 bottom
L9  150uH  [L1812]  60,8 270 bottom
L10  MH2029-300Y  [0805]  104.25,10.25 180 top
L11  10u SRR0604-100ML  [SRR0604]  111.5,15 0 top
PC1  47u  [PANASONIC_D]  104,15.75 270 top
PC2  47u  [PANASONIC_D]  111.75,25.25 180 top
PSU  310010495_STM32F401RET6  [LQFP64]  74.88,8.12 0 bottom
Q1  BSS123  [SOT23]  64.25,16 270 bottom
Q2  BSS123  [SOT23]  65.5,4.5 180 bottom
R1  1K  [R1206]  58.75,23.75 90 bottom
R2  1k  [R1206]  58.75,30 90 bottom
R3  330  [R0603]  68.5,13.25 180 top
R4  10K  [R0805]  95.38,30.75 90 bottom
R5  100K  [R0603]  43.55,9.3 270 bottom
R6  n.a.  [R0603]  93.5,16 90 bottom
R7  20  [R0603]  69.75,17.88 0 bottom
R8  20  [R0603]  81.38,15.75 0 bottom
R9  0  [R1206]  78,29.75 0 bottom
R10  820  [R0603]  67.25,15.9 270 bottom
R11  32.4k  [R0603]  64,14 180 top
R12  820  [R0603]  62.75,4.75 90 bottom
R13  10K  [R0603']  110.25,20 0 bottom
R14  10K  [R0603']  108.75,20 180 bottom
R15  1k  [R1206]  52.75,23.75 90 bottom
R16  1k  [R1206]  52.75,30 90 bottom
R17  1k  [R0603]  81.38,19.5 180 bottom
R18  30K  [R0603]  85.25,12.75 0 bottom
R19  51k  [R0603']  108.75,20 0 top
R20  820  [R0603]  58.75,18.2 180 bottom
R21  1M  [R0603]  61,14 180 top
R22  330  [R0603]  71.5,13.25 0 top
R23  10k  [R0603]  94,19.25 90 top
R24  5100  [R0603]  81.25,24 270 bottom
R25  100K  [R0603]  44.92,9.3 270 bottom
R26  1k  [R0603]  66,21.5 180 bottom
R27  30K  [R0603]  69.75,19.62 0 bottom
R28  5100  [R0603]  66.5,24.25 90 bottom
R29  10k  [R0603]  96.5,19.25 270 top
R30  10  [R0603]  9.5,13.15 180 bottom
R31  0  [R0603]  14,12.42 90 bottom
R32  10K  [R0805]  91.58,30.73 90 bottom
R34  330  [R0603]  22.75,6 0 bottom
R35  330  [R0603]  25.75,6 180 bottom
R36  330R  [R0603]  32.25,31.25 0 bottom
R37  330R  [R0603]  32.25,29.25 0 bottom
R38  10k  [R0603]  23.72,30.46 270 bottom
R39  10k  [R0603]  26.5,25 180 bottom
R40  100K  [R0603]  23.5,26 0 top
R41  100k  [R0603]  26.5,26 0 top
R42  200k  [R0603]  60,16 180 top
R43  10k  [R0603]  62.5,16.5 270 top
R45  330  [R0603]  87.38,7.62 90 top
R47  820  [R0603]  59.5,3.25 270 bottom
R49  1M  [R0603]  61.5,5.75 180 top
R50  32.4k  [R0603]  64.5,5 180 top
R52  200k  [R0603]  60.5,7.75 0 top
R53  10k  [R0603]  60.5,9.75 180 top
R54  10k  [R0603]  26.5,24 180 top
R55  10k  [R0603]  21.75,14.75 270 bottom
R56  100k  [R0603]  21.75,20.75 90 bottom
R57  100k  [R0603]  21.75,23.75 90 bottom
R58  10k  [R0603]  39.75,21.25 270 bottom
R59  10k  [R0603]  49.5,24 90 bottom
R60  100k  [R0603]  41,18.75 180 bottom
R61  100k  [R0603]  44,19 180 bottom
R62  10k  [R0603]  41.75,30.25 0 bottom
R63  10k  [R0603]  41.75,28.25 0 bottom
R64  100  [R0603]  52,18.5 270 bottom
R65  500k  [R0603]  39.75,14 270 bottom
R66  10  [R0603]  39.75,11 270 bottom
R67  10K  [R0805]  93.38,30.75 270 bottom
R68  10K  [R0805]  89.75,30.72 90 bottom
R71  1k  [R0603]  41.75,10.5 90 bottom
R73  100  [R0603]  55.25,18.5 270 bottom
R74  500k  [R0603]  53.5,14.75 270 bottom
R75  10  [R0603]  46.92,10.53 270 bottom
R77  1k  [R0603]  55.63,10.38 90 bottom
SIPM1X1_BOT  [DIODE_ASD-NUV1S-P]  57.55,62.3 270 bottom
SIPM1X1_TOP  [DIODE_ASD-NUV1S-P]  61.55,62.3 270 top
SIPM3X3_BOT  [DIODE_ASD-NUV3S-P]  57.5,58.65 270 bottom
SIPM3X3_TOP  [DIODE_ASD-NUV3S-P]  61.5,58.65 270 top
U1  L76-M33  [CAPCAV110P970X1010X250-18N]  8.72,20.15 270 bottom
U3  MCP4725  [SOT23-6']  102.63,23.88 270 bottom
U4  MCP4725  [SOT23-6']  102.38,29.62 270 bottom
U$1  FIDUCIAL  [FIDUCIAL_1MM]  115.58,45.98 0 bottom
U$2  FIDUCIAL  [FIDUCIAL_1MM]  21.79,10.48 0 top
U$3  FIDUCIAL  [FIDUCIAL_1MM]  54.5,59 0 top
U$4  FIDUCIAL  [FIDUCIAL_1MM]  45.21,22.98 0 top
U$5  FIDUCIAL  [FIDUCIAL_1MM]  115.7,20.03 0 top
U$6  FIDUCIAL  [FIDUCIAL_1MM]  64.63,58.98 0 bottom
U$7  FIDUCIAL  [FIDUCIAL_1MM]  106.59,38.23 0 top
U$8  FIDUCIAL  [FIDUCIAL_1MM]  17.8,19.73 0 bottom
USB1  10118193-0001LF  [MICRO-USB5+6P-SMD-0.65-B]  86.5,4.75 0 bottom
X1  POWERSUPPLY_DC21MMX  [POWERSUPPLY_DC-21MM]  97,6.5 180 bottom
X2  306010032_XTAL_8MHZ_5032_4P  [X5032_4P]  31.25,3.5 90 bottom
X4  1296-T08  [1296-08]  39,23 180 top
X5  1296-T08  [1296-08]  82,16.5 90 top